# Altium schematic sheet schematic.SchDoc
size A2 portrait; SheetNumber: 6; SheetTotal: 29
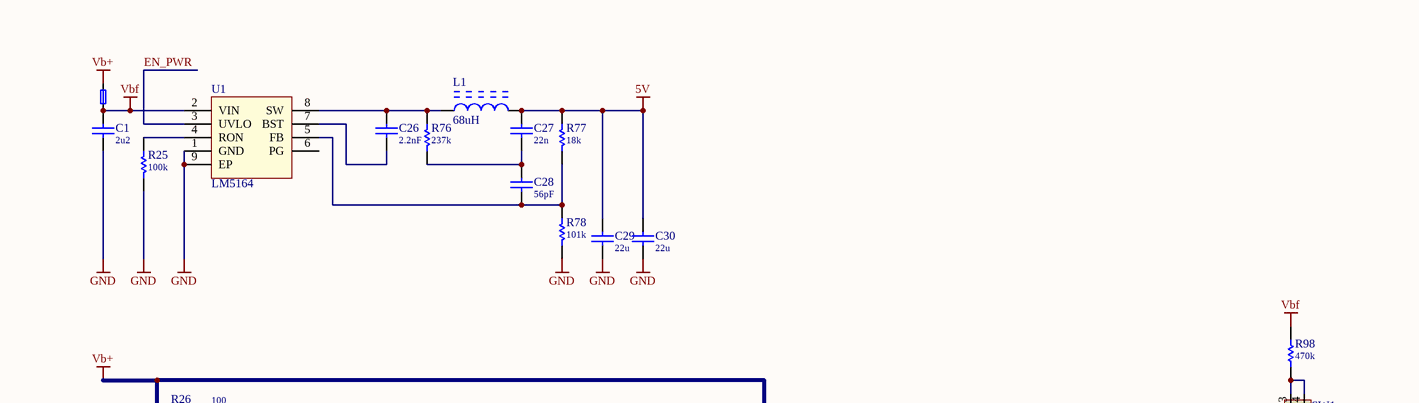
[diagram p0: schematic.SchDoc, top]
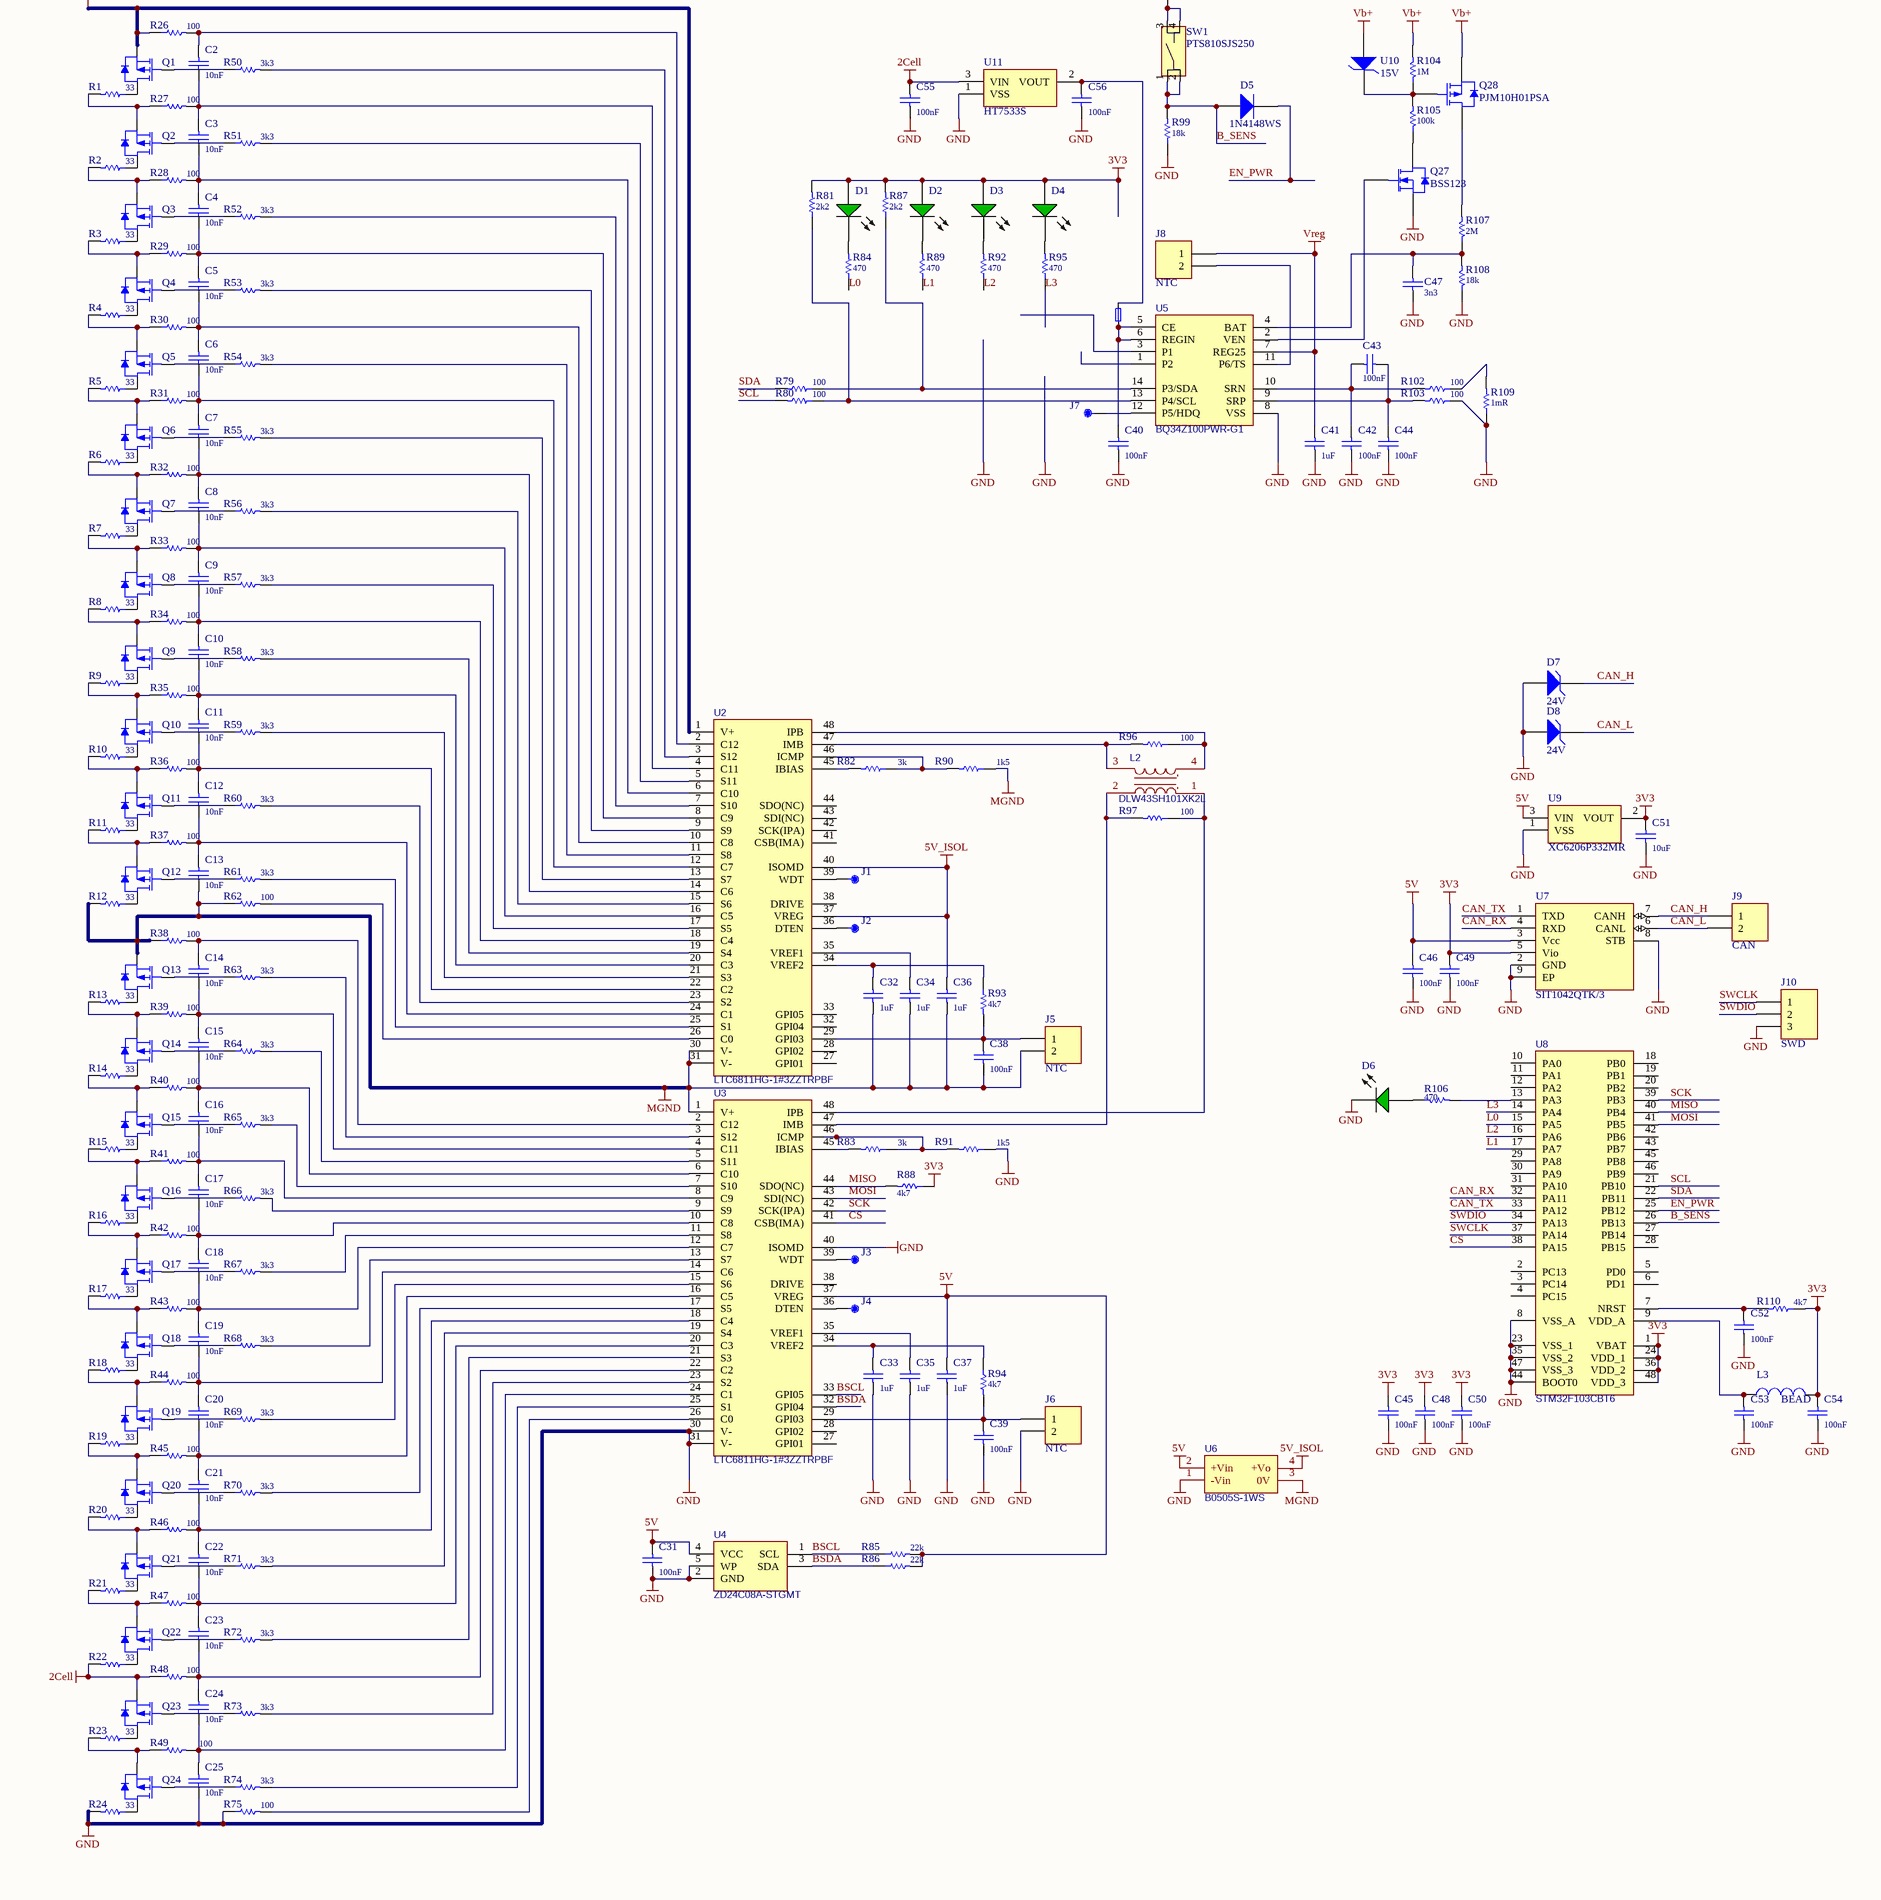
[diagram p1: schematic.SchDoc, bottom]

## Parts
C1  2u2  [C1210]
C2  10nF  [C0603]
C3  10nF  [C0603]
C4  10nF  [C0603]
C5  10nF  [C0603]
C6  10nF  [C0603]
C7  10nF  [C0603]
C8  10nF  [C0603]
C9  10nF  [C0603]
C10  10nF  [C0603]
C11  10nF  [C0603]
C12  10nF  [C0603]
C13  10nF  [C0603]
C14  10nF  [C0603]
C15  10nF  [C0603]
C16  10nF  [C0603]
C17  10nF  [C0603]
C18  10nF  [C0603]
C19  10nF  [C0603]
C20  10nF  [C0603]
C21  10nF  [C0603]
C22  10nF  [C0603]
C23  10nF  [C0603]
C24  10nF  [C0603]
C25  10nF  [C0603]
C26  2.2nF  [C0603]
C27  22n  [C0603]
C28  56pF  [C0603]
C29  22u  [C1210]
C30  22u  [C1210]
C31  100nF  [C0402]
C32  1uF  [C0603]
C33  1uF  [C0603]
C34  1uF  [C0603]
C35  1uF  [C0603]
C36  1uF  [C0603]
C37  1uF  [C0603]
C38  100nF  [C0402]
C39  100nF  [C0402]
C40  100nF  [C0603]
C41  1uF  [C0603]
C42  100nF  [C0603]
C43  100nF  [C0603]
C44  100nF  [C0603]
C45  100nF  [C0402]
C46  100nF  [C0402]
C47  3n3  [C0603]
C48  100nF  [C0402]
C49  100nF  [C0402]
C50  100nF  [C0402]
C51  10uF  [C1206]
C52  100nF  [C0402]
C53  100nF  [C0402]
C54  100nF  [C0402]
C55  100nF  [C0603]
C56  100nF  [C0603]
D1  GRN  [LED-0603-GRN]  (value not drawn)
D2  GRN  [LED-0603-GRN]  (value not drawn)
D3  GRN  [LED-0603-GRN]  (value not drawn)
D4  GRN  [LED-0603-GRN]  (value not drawn)
D5  1N4148WS  [SOD-323]
D6  GRN  [LED-0603-GRN]  (value not drawn)
D7  24V  [SOD-123FL]
D8  24V  [SOD-123FL]
F1  1A  [FUSE-1206]  (value not drawn)
F2  1A  [FUSE-1206]  (value not drawn)
J1  (no value)  [TP30_SMD]
J2  (no value)  [TP30_SMD]
J3  (no value)  [TP30_SMD]
J4  (no value)  [TP30_SMD]
J5  NTC  [HDR-1X2]  (no BOM)
J6  NTC  [HDR-1X2]  (no BOM)
J7  (no value)  [TP30_SMD]
J8  NTC  [HDR-1X2]  (no BOM)
J9  CAN  [HDR-1X2]  (no BOM)
J10  SWD  [HDR-1X3]  (no BOM)
L1  68uH  [L0605-POWER]
L2  DLW43SH101XK2L  [FILTER-SMD_4P-L4.5-W3.2-BL]
L3  BEAD  [L0402]
Q1  BSS308PE-VB  [SOT-23]  (value not drawn)
Q2  BSS308PE-VB  [SOT-23]  (value not drawn)
Q3  BSS308PE-VB  [SOT-23]  (value not drawn)
Q4  BSS308PE-VB  [SOT-23]  (value not drawn)
Q5  BSS308PE-VB  [SOT-23]  (value not drawn)
Q6  BSS308PE-VB  [SOT-23]  (value not drawn)
Q7  BSS308PE-VB  [SOT-23]  (value not drawn)
Q8  BSS308PE-VB  [SOT-23]  (value not drawn)
Q9  BSS308PE-VB  [SOT-23]  (value not drawn)
Q10  BSS308PE-VB  [SOT-23]  (value not drawn)
Q11  BSS308PE-VB  [SOT-23]  (value not drawn)
Q12  BSS308PE-VB  [SOT-23]  (value not drawn)
Q13  BSS308PE-VB  [SOT-23]  (value not drawn)
Q14  BSS308PE-VB  [SOT-23]  (value not drawn)
Q15  BSS308PE-VB  [SOT-23]  (value not drawn)
Q16  BSS308PE-VB  [SOT-23]  (value not drawn)
Q17  BSS308PE-VB  [SOT-23]  (value not drawn)
Q18  BSS308PE-VB  [SOT-23]  (value not drawn)
Q19  BSS308PE-VB  [SOT-23]  (value not drawn)
Q20  BSS308PE-VB  [SOT-23]  (value not drawn)
Q21  BSS308PE-VB  [SOT-23]  (value not drawn)
Q22  BSS308PE-VB  [SOT-23]  (value not drawn)
Q23  BSS308PE-VB  [SOT-23]  (value not drawn)
Q24  BSS308PE-VB  [SOT-23]  (value not drawn)
Q27  BSS123  [SOT-23]
Q28  PJM10H01PSA  [SOT-23]
R1  33  [R2512]
R2  33  [R2512]
R3  33  [R2512]
R4  33  [R2512]
R5  33  [R2512]
R6  33  [R2512]
R7  33  [R2512]
R8  33  [R2512]
R9  33  [R2512]
R10  33  [R2512]
R11  33  [R2512]
R12  33  [R2512]
R13  33  [R2512]
R14  33  [R2512]
R15  33  [R2512]
R16  33  [R2512]
R17  33  [R2512]
R18  33  [R2512]
R19  33  [R2512]
R20  33  [R2512]
R21  33  [R2512]
R22  33  [R2512]
R23  33  [R2512]
R24  33  [R2512]
R25  100k  [R0603]
R26  100  [R0603]
R27  100  [R0603]
R28  100  [R0603]
R29  100  [R0603]
R30  100  [R0603]
R31  100  [R0603]
R32  100  [R0603]
R33  100  [R0603]
R34  100  [R0603]
R35  100  [R0603]
R36  100  [R0603]
R37  100  [R0603]
R38  100  [R0603]
R39  100  [R0603]
R40  100  [R0603]
R41  100  [R0603]
R42  100  [R0603]
R43  100  [R0603]
R44  100  [R0603]
R45  100  [R0603]
R46  100  [R0603]
R47  100  [R0603]
R48  100  [R0603]
R49  100  [R0603]
R50  3k3  [R0603]
R51  3k3  [R0603]
R52  3k3  [R0603]
R53  3k3  [R0603]
R54  3k3  [R0603]
R55  3k3  [R0603]
R56  3k3  [R0603]
R57  3k3  [R0603]
R58  3k3  [R0603]
R59  3k3  [R0603]
R60  3k3  [R0603]
R61  3k3  [R0603]
R62  100  [R0603]
R63  3k3  [R0603]
R64  3k3  [R0603]
R65  3k3  [R0603]
R66  3k3  [R0603]
R67  3k3  [R0603]
R68  3k3  [R0603]
R69  3k3  [R0603]
R70  3k3  [R0603]
R71  3k3  [R0603]
R72  3k3  [R0603]
R73  3k3  [R0603]
R74  3k3  [R0603]
R75  100  [R0603]
R76  237k  [R0603]
R77  18k  [R0603]
R78  101k  [R0603]
R79  100  [R0603]
R80  100  [R0603]
R81  2k2  [R0603]
R82  3k  [R0603]
R83  3k  [R0603]
R84  470  [R0603]
R85  22k  [R0402]
R86  22k  [R0402]
R87  2k2  [R0603]
R88  4k7  [R0402]
R89  470  [R0603]
R90  1k5  [R0603]
R91  1k5  [R0603]
R92  470  [R0603]
R93  4k7  [R0603]
R94  4k7  [R0603]
R95  470  [R0603]
R96  100  [R0603]
R97  100  [R0603]
R98  470k  [R1206]
R99  18k  [R0603]
R102  100  [R0603]
R103  100  [R0603]
R104  1M  [R1206]
R105  100k  [R1206]
R106  470  [R0603]
R107  2M  [R1206]
R108  18k  [R0603]
R109  1mR  [R5930_SHUNT]
R110  4k7  [R0402]
SW1  PTS810SJS250  [BTN_PTS810]
U1  LM5164  [PowerSOIC-8]
U2  LTC6811HG-1#3ZZTRPBF  [SSOP-48_L12.8-W5.3-P0.50-LS7.8-BL]
U3  LTC6811HG-1#3ZZTRPBF  [SSOP-48_L12.8-W5.3-P0.50-LS7.8-BL]
U4  ZD24C08A-STGMT  [SOT-23-5]
U5  BQ34Z100PWR-G1  [TSSOP-14_L5.0-W4.4-P0.65-LS6.4-BL]
U6  B0505S-1WS  [B0505S-1WS]
U7  SIT1042QTK/3  [DFN8_3X3_P065]
U8  STM32F103CBT6  [LQFP-48]
U9  XC6206P332MR  [SOT-23]
U10  15V  [SOD-323]
U11  HT7533S  [SOT-23]

## Nets
2Cell: C55.2 Q23.2(SOURCE) R22.2 R48.1 U11.3(VIN)
3V3: C45.2 C48.2 C49.2 C50.2 C51.2 C54.2 D1.1(A) D2.1(A) D3.1(A) D4.1(A) L3.1 R81.2 R87.2 R88.1 R110.1 U7.5(Vio) U8.1(VBAT) U8.24(VDD_1) U8.36(VDD_2) U8.48(VDD_3) U9.2(VOUT)
5V: C27.2 C29.2 C30.2 C31.2 C37.2 C46.2 L1.2 R77.1 R85.2 R86.2 U3.37(VREG) U4.4(VCC) U6.2(+Vin) U7.3(Vcc) U9.3(VIN)
5V_ISOL: C36.2 U2.37(VREG) U2.40(ISOMD) U6.4(+Vo)
GND: C1.1 C25.1 C29.1 C30.1 C31.1 C33.1 C35.1 C37.1 C39.1 C40.1 C41.1 C42.1 C44.1 C45.1 C46.1 C47.2 C48.1 C49.1 C50.1 C51.1 C52.1 C53.1 C54.1 C55.1 C56.1 D6.2(K) D7.1(A) D8.1(A) J6.2 J10.3 Q27.2(SOURCE) R24.2 R25.2 R75.1 R78.2 R91.1 R99.1 R103.1 R108.1 R109.1 U1.1(GND) U1.9(EP) U3.30(V-) U3.31(V-) U3.40(ISOMD) U4.2(GND) U4.5(WP) U5.8(VSS) U6.1(-Vin) U7.2(GND) U7.8(STB) U7.9(EP) U8.8(VSS_A) U8.23(VSS_1) U8.35(VSS_2) U8.44(BOOT0) U8.47(VSS_3) U9.1(VSS) U11.1(VSS)
MGND: C13.1 C32.1 C34.1 C36.1 C38.1 J5.2 Q13.2(SOURCE) R12.2 R38.1 R62.1 R90.1 U2.30(V-) U2.31(V-) U3.1(V+) U6.3(0V)
Vb+: F1.2 Q1.2(SOURCE) Q28.2(SOURCE) R26.1 R104.2 U2.1(V+) U10.2(-)
Vbf: C1.2 F1.1 R98.1 U1.2(VIN)
Vreg: C41.2 J8.1 U5.7(REG25)
B_SENS: D5.1(A) R99.2 SW1.1 SW1.2 U8.26(PB13)
BSCL: R85.1 U3.33(GPI05) U4.1(SCL)
BSDA: R86.1 U3.32(GPI04) U4.3(SDA)
CAN_H: D7.2(K) J9.1 U7.7(CANH)
CAN_L: D8.2(K) J9.2 U7.6(CANL)
CAN_RX: U7.4(RXD) U8.32(PA11)
CAN_TX: U7.1(TXD) U8.33(PA12)
CS: U3.41(CSB(IMA)) U8.38(PA15)
EN_PWR: D5.2(K) U1.3(UVLO) U8.25(PB12)
L0: R84.1 U8.15(PA5)
L1: R89.1 U8.17(PA7)
L2: R92.1 U8.16(PA6)
L3: R95.1 U8.14(PA4)
MISO: R88.2 U3.44(SDO(NC)) U8.40(PB4)
MOSI: U3.43(SDI(NC)) U8.41(PB5)
SCK: U3.42(SCK(IPA)) U8.39(PB3)
SCL: R80.2 U8.21(PB10)
SDA: R79.2 U8.22(PB11)
SWCLK: J10.1 U8.37(PA14)
SWDIO: J10.2 U8.34(PA13)
NetC2_1: C2.1 C3.2 R27.2 U2.4(C11)
NetC2_2: C2.2 R26.2 U2.2(C12)
NetC3_1: C3.1 C4.2 R28.2 U2.6(C10)
NetC4_1: C4.1 C5.2 R29.2 U2.8(C9)
NetC5_1: C5.1 C6.2 R30.2 U2.10(C8)
NetC6_1: C6.1 C7.2 R31.2 U2.12(C7)
NetC7_1: C7.1 C8.2 R32.2 U2.14(C6)
NetC8_1: C8.1 C9.2 R33.2 U2.16(C5)
NetC9_1: C9.1 C10.2 R34.2 U2.18(C4)
NetC10_1: C10.1 C11.2 R35.2 U2.20(C3)
NetC11_1: C11.1 C12.2 R36.2 U2.22(C2)
NetC12_1: C12.1 C13.2 R37.2 U2.24(C1)
NetC14_1: C14.1 C15.2 R39.2 U3.4(C11)
NetC14_2: C14.2 R38.2 U3.2(C12)
NetC15_1: C15.1 C16.2 R40.2 U3.6(C10)
NetC16_1: C16.1 C17.2 R41.2 U3.8(C9)
NetC17_1: C17.1 C18.2 R42.2 U3.10(C8)
NetC18_1: C18.1 C19.2 R43.2 U3.12(C7)
NetC19_1: C19.1 C20.2 R44.2 U3.14(C6)
NetC20_1: C20.1 C21.2 R45.2 U3.16(C5)
NetC21_1: C21.1 C22.2 R46.2 U3.18(C4)
NetC22_1: C22.1 C23.2 R47.2 U3.20(C3)
NetC23_1: C23.1 C24.2 R48.2 U3.22(C2)
NetC24_1: C24.1 C25.2 R49.2 U3.24(C1)
NetC26_1: C26.1 U1.7(BST)
NetC26_2: C26.2 L1.1 R76.1 U1.8(SW)
NetC27_1: C27.1 C28.2 R76.2
NetC28_1: C28.1 R77.2 R78.1 U1.5(FB)
NetC32_2: C32.2 R93.1 U2.34(VREF2)
NetC33_2: C33.2 R94.1 U3.34(VREF2)
NetC34_2: C34.2 U2.35(VREF1)
NetC35_2: C35.2 U3.35(VREF1)
NetC38_2: C38.2 J5.1 R93.2 U2.29(GPI03)
NetC39_2: C39.2 J6.1 R94.2 U3.29(GPI03)
NetC40_2: C40.2 F2.1 U5.5(CE) U5.6(REGIN)
NetC42_2: C42.2 C43.2 R102.2 U5.10(SRN)
NetC43_1: C43.1 C44.2 R103.2 U5.9(SRP)
NetC47_1: C47.1 R107.1 R108.2 U5.4(BAT)
NetC52_2: C52.2 R110.2 U8.7(NRST)
NetC53_2: C53.2 L3.2 U8.9(VDD_A)
NetC56_2: C56.2 F2.2 U11.2(VOUT)
NetD1_2: D1.2(K) R84.2
NetD2_2: D2.2(K) R89.2
NetD3_2: D3.2(K) R92.2
NetD4_2: D4.2(K) R95.2
NetD6_1: D6.1(A) R106.1
NetJ1_1: J1.1 U2.39(WDT)
NetJ2_1: J2.1 U2.36(DTEN)
NetJ3_1: J3.1 U3.39(WDT)
NetJ4_1: J4.1 U3.36(DTEN)
NetJ7_1: J7.1 U5.12(P5/HDQ)
NetJ8_2: J8.2 U5.11(P6/TS)
NetL2_1: L2.1 R97.1 U3.48(IPB)
NetL2_2: L2.2 R97.2 U3.47(IMB)
NetL2_3: L2.3 R96.2 U2.47(IMB)
NetL2_4: L2.4 R96.1 U2.48(IPB)
NetQ1_1: Q1.1(GATE) R50.1
NetQ1_3: Q1.3(DRAIN) R1.1
NetQ2_1: Q2.1(GATE) R51.1
NetQ2_2: Q2.2(SOURCE) R1.2 R27.1
NetQ2_3: Q2.3(DRAIN) R2.1
NetQ3_1: Q3.1(GATE) R52.1
NetQ3_2: Q3.2(SOURCE) R2.2 R28.1
NetQ3_3: Q3.3(DRAIN) R3.1
NetQ4_1: Q4.1(GATE) R53.1
NetQ4_2: Q4.2(SOURCE) R3.2 R29.1
NetQ4_3: Q4.3(DRAIN) R4.1
NetQ5_1: Q5.1(GATE) R54.1
NetQ5_2: Q5.2(SOURCE) R4.2 R30.1
NetQ5_3: Q5.3(DRAIN) R5.1
NetQ6_1: Q6.1(GATE) R55.1
NetQ6_2: Q6.2(SOURCE) R5.2 R31.1
NetQ6_3: Q6.3(DRAIN) R6.1
NetQ7_1: Q7.1(GATE) R56.1
NetQ7_2: Q7.2(SOURCE) R6.2 R32.1
NetQ7_3: Q7.3(DRAIN) R7.1
NetQ8_1: Q8.1(GATE) R57.1
NetQ8_2: Q8.2(SOURCE) R7.2 R33.1
NetQ8_3: Q8.3(DRAIN) R8.1
NetQ9_1: Q9.1(GATE) R58.1
NetQ9_2: Q9.2(SOURCE) R8.2 R34.1
NetQ9_3: Q9.3(DRAIN) R9.1
NetQ10_1: Q10.1(GATE) R59.1
NetQ10_2: Q10.2(SOURCE) R9.2 R35.1
NetQ10_3: Q10.3(DRAIN) R10.1
NetQ11_1: Q11.1(GATE) R60.1
NetQ11_2: Q11.2(SOURCE) R10.2 R36.1
NetQ11_3: Q11.3(DRAIN) R11.1
NetQ12_1: Q12.1(GATE) R61.1
NetQ12_2: Q12.2(SOURCE) R11.2 R37.1
NetQ12_3: Q12.3(DRAIN) R12.1
NetQ13_1: Q13.1(GATE) R63.1
NetQ13_3: Q13.3(DRAIN) R13.1
NetQ14_1: Q14.1(GATE) R64.1
NetQ14_2: Q14.2(SOURCE) R13.2 R39.1
NetQ14_3: Q14.3(DRAIN) R14.1
NetQ15_1: Q15.1(GATE) R65.1
NetQ15_2: Q15.2(SOURCE) R14.2 R40.1
NetQ15_3: Q15.3(DRAIN) R15.1
NetQ16_1: Q16.1(GATE) R66.1
NetQ16_2: Q16.2(SOURCE) R15.2 R41.1
NetQ16_3: Q16.3(DRAIN) R16.1
NetQ17_1: Q17.1(GATE) R67.1
NetQ17_2: Q17.2(SOURCE) R16.2 R42.1
NetQ17_3: Q17.3(DRAIN) R17.1
NetQ18_1: Q18.1(GATE) R68.1
NetQ18_2: Q18.2(SOURCE) R17.2 R43.1
NetQ18_3: Q18.3(DRAIN) R18.1
NetQ19_1: Q19.1(GATE) R69.1
NetQ19_2: Q19.2(SOURCE) R18.2 R44.1
NetQ19_3: Q19.3(DRAIN) R19.1
NetQ20_1: Q20.1(GATE) R70.1
NetQ20_2: Q20.2(SOURCE) R19.2 R45.1
NetQ20_3: Q20.3(DRAIN) R20.1
NetQ21_1: Q21.1(GATE) R71.1
NetQ21_2: Q21.2(SOURCE) R20.2 R46.1
NetQ21_3: Q21.3(DRAIN) R21.1
NetQ22_1: Q22.1(GATE) R72.1
NetQ22_2: Q22.2(SOURCE) R21.2 R47.1
NetQ22_3: Q22.3(DRAIN) R22.1
NetQ23_1: Q23.1(GATE) R73.1
NetQ23_3: Q23.3(DRAIN) R23.1
NetQ24_1: Q24.1(GATE) R74.1
NetQ24_2: Q24.2(SOURCE) R23.2 R49.1
NetQ24_3: Q24.3(DRAIN) R24.1
NetQ27_1: Q27.1(GATE) U5.2(VEN)
NetQ27_3: Q27.3(DRAIN) R105.1
NetQ28_1: Q28.1(GATE) R104.1 R105.2 U10.1(+)
NetQ28_3: Q28.3(DRAIN) R107.2
NetR25_1: R25.1 U1.4(RON)
NetR50_2: R50.2 U2.3(S12)
NetR51_2: R51.2 U2.5(S11)
NetR52_2: R52.2 U2.7(S10)
NetR53_2: R53.2 U2.9(S9)
NetR54_2: R54.2 U2.11(S8)
NetR55_2: R55.2 U2.13(S7)
NetR56_2: R56.2 U2.15(S6)
NetR57_2: R57.2 U2.17(S5)
NetR58_2: R58.2 U2.19(S4)
NetR59_2: R59.2 U2.21(S3)
NetR60_2: R60.2 U2.23(S2)
NetR61_2: R61.2 U2.25(S1)
NetR62_2: R62.2 U2.26(C0)
NetR63_2: R63.2 U3.3(S12)
NetR64_2: R64.2 U3.5(S11)
NetR65_2: R65.2 U3.7(S10)
NetR66_2: R66.2 U3.9(S9)
NetR67_2: R67.2 U3.11(S8)
NetR68_2: R68.2 U3.13(S7)
NetR69_2: R69.2 U3.15(S6)
NetR70_2: R70.2 U3.17(S5)
NetR71_2: R71.2 U3.19(S4)
NetR72_2: R72.2 U3.21(S3)
NetR73_2: R73.2 U3.23(S2)
NetR74_2: R74.2 U3.25(S1)
NetR75_2: R75.2 U3.26(C0)
NetR79_1: R79.1 R87.1 U5.14(P3/SDA)
NetR80_1: R80.1 R81.1 U5.13(P4/SCL)
NetR82_1: R82.1 R90.2 U2.46(ICMP)
NetR82_2: R82.2 U2.45(IBIAS)
NetR83_1: R83.1 R91.2 U3.46(ICMP)
NetR83_2: R83.2 U3.45(IBIAS)
NetR98_2: R98.2 SW1.3 SW1.4
NetR102_1: R102.1 R109.2
NetR106_2: R106.2 U8.13(PA3)

Not connected (* = marked no-connect by the designer): U1 6(PG); U2 27(GPI01) 28(GPI02) 32(GPI04) 33(GPI05) 38(DRIVE) 41(CSB(IMA)) 42(SCK(IPA)) 43(SDI(NC)) 44(SDO(NC)); U3 27(GPI01) 28(GPI02) 38(DRIVE); U5 1(P2) 3(P1); U8 2(PC13) 3(PC14) 4(PC15) 5(PD0) 6(PD1) 10(PA0) 11(PA1) 12(PA2) 18(PB0) 19(PB1) 20(PB2) 27(PB14) 28(PB15) 29(PA8) 30(PA9) 31(PA10) 42(PB6) 43(PB7) 45(PB8) 46(PB9)

## Library data of the parts
C1 = CAP: 2.2uF 100V 1210
C2-C25 = CAP: 10nF 50V 0603
C26 = CAP: 2.2nF 50V 0603
C27 = CAP: 2.2nF 0603
C28 = CAP: 56pF 0603
C29 C30 = CAP: 22u 35V 1210
C31 C38 C39 C45 C46 C48-C50 C52-C54 = CAP: 100nF 50V 0402
C32-C37 C41 = CAP: 1uF 0603
C40 C42-C44 C55 C56 = CAP: 100nF 50V 0603
C47 = CAP: 3n3 100V 0603
C51 = CAP: 10uf 50V 1206
D1-D4 D6 = LED-0603-GREEN: LED 0603 GRN
D5 = US1M-13-F
D7 D8 = SMCJ54A: P6SMB24A
F1 F2 = Fuse 1: P/N: TLC-LSMD075/60; LCSC part number: C2924950
J1-J4 J7 = TP_Dup1
J5 J6 J8 J9 = Header 2
J10 = Header 3
L1 = SRN3015-100M: PSPMAA0605H-680M-IGF
L3 = BLM18AG601SN1D: BEAD 0402
Q1-Q24 Q27 Q28 = 2N7002
R1-R24 = RES: 33R 2512
R25 = RES: 100k 0603
R26-R49 R62 R75 R79 R80 R96 R97 R102 R103 = RES: 100R 0603
R50-R61 R63-R74 = RES: 3k3 0603
R76 = RES: 237k 0603
R77 = RES: 18k 1% 0603
R78 = RES: 101k 0603
R81 R87 = RES: 2.2k 0603
R82 R83 = RES: 3k 0603
R84 R89 R92 R95 = RES: 470R 0603
R85 R86 = RES: 22k 0402
R88 R93 R94 = RES: 4.7k 0603
R90 R91 = RES: 1.5k 0603
R98 = RES: 470k 1206
R99 R108 = RES: 18k 0603
R104 = RES: 1M 1206
R105 = RES: 100k 1206
R106 = RES: 470 0603
R107 = RES: 2M 1206
R109 = RES: HolRS5930-7W-1mR-1%
R110 = RES: 4k7 0402
SW1 = Component_1
U6 = B0505S-1WR3_C512048
U7 = LTC2875: IC INTERFACE CAN
U9 U11 = Component_4_1
U10 = NCP51460SN33T1G: BZT52C15S